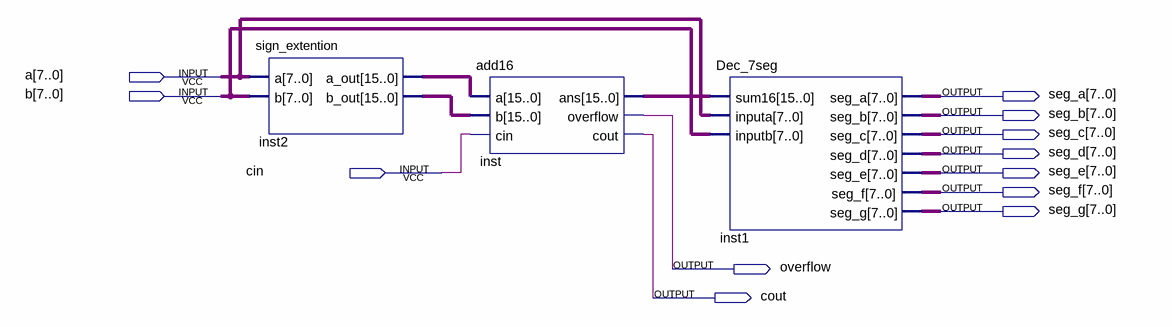
[diagram p0: schematic sheet]
// Quartus schematic addsub16_7segment.bdf as structural Verilog: 3 symbols, 12 pins
module addsub16_7segment (
  input  [7:0] a,
  input  [7:0] b,
  input  cin,
  output [7:0] seg_a,
  output [7:0] seg_b,
  output [7:0] seg_c,
  output [7:0] seg_d,
  output [7:0] seg_e,
  output [7:0] seg_f,
  output [7:0] seg_g,
  output overflow,
  output cout
);

  wire [15:0] inst2_a_out, inst2_b_out, inst_ans;

  sign_extention inst2 (.a(a), .b(b), .a_out(inst2_a_out), .b_out(inst2_b_out));
  add16 inst (.a(inst2_a_out), .b(inst2_b_out), .cin(cin), .ans(inst_ans), .overflow(overflow), .cout(cout));
  Dec_7seg inst1 (
    .sum16(inst_ans), .inputa(a), .inputb(b), .seg_a(seg_a), .seg_b(seg_b), .seg_c(seg_c), .seg_d(seg_d),
    .seg_e(seg_e), .seg_f(seg_f), .seg_g(seg_g));
endmodule
